# EAGLE design noise_patrol_board (EAGLE 9.6.2)
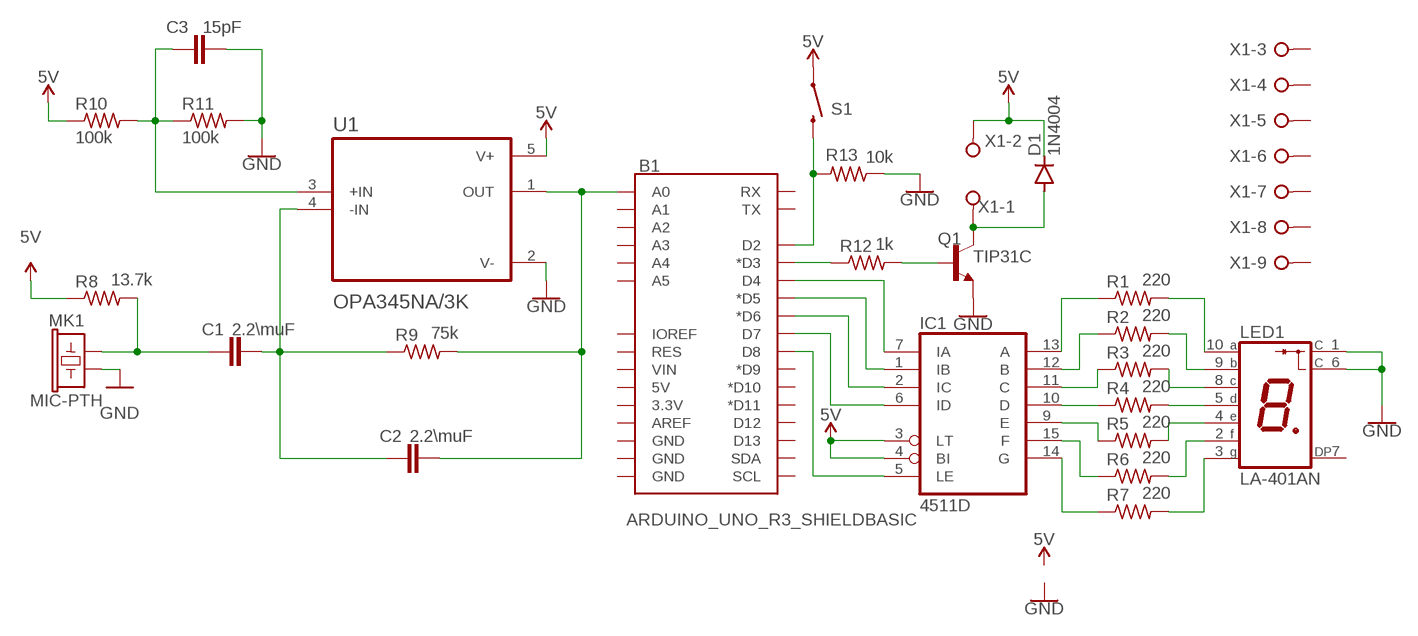
[diagram p0: schematic, sheet 1]

## Parts
B1  ARDUINO_UNO_R3_SHIELDBASIC  [UNO_R3_SHIELD]
C1  2.2\muF  0.22UF-0603-50V-10%  [0603]
C2  2.2\muF  0.22UF-0603-50V-10%  [0603]
C3  15pF  0.22UF-0603-50V-10%  [0603]
D1  1N4004  [DO41-10]
IC1  4511D  [SO16]
LED1  LA-401AN  [LA-401]
MK1  MIC-PTH  [MICROPHONE-PTH-9.7MM]
Q1  TIP31C  [TO220]
R1  220  R-US_0204/7  [0204/7]
R2  220  R-US_0204/7  [0204/7]
R3  220  R-US_0204/7  [0204/7]
R4  220  R-US_0204/7  [0204/7]
R5  220  R-US_0204/7  [0204/7]
R6  220  R-US_0204/7  [0204/7]
R7  220  R-US_0204/7  [0204/7]
R8  13.7k  R-US_M1206  [M1206]
R9  75k  R-US_M1206  [M1206]
R10  100k  R-US_M1206  [M1206]
R11  100k  R-US_M1206  [M1206]
R12  1k  R-US_M1206  [M1206]
R13  10k  R-US_M1206  [M1206]
S1  Reset button  MOMENTARY-SWITCH-SPST-PTH-6.0MM  [TACTILE_SWITCH_PTH_6.0MM]
U1  OPA345NA/3K  [SOT95P280X145-5N]
X1  W237-09P  [W237-9P]

## Nets
5V: D1.C IC1.3(LT) IC1.4(BI) R8.1 R10.1 S1.1 U1.5(V+) X1.2
GND: C3.2 LED1.1(C) LED1.6(C) MK1.GND Q1.3(E) R11.2 R13.1 U1.2(V-)
N$1: IC1.12(B) R2.1
N$2: IC1.11(C) R3.1
N$3: IC1.10(D) R4.1
N$4: IC1.9(E) R5.1
N$5: IC1.15(F) R6.1
N$6: IC1.14(G) R7.1
N$7: LED1.3(G) R7.2
N$8: LED1.2(F) R6.2
N$9: LED1.4(E) R5.2
N$10: LED1.5(D) R4.2
N$11: LED1.8(C) R3.2
N$12: LED1.9(B) R2.2
N$13: LED1.10(A) R1.2
N$14: B1.D4 IC1.7(IA)
N$15: B1.D5(*D5) IC1.1(IB)
N$16: B1.D6(*D6) IC1.2(IC)
N$17: B1.D7 IC1.6(ID)
N$18: B1.A0 C2.2 R9.2 U1.1(OUT)
N$19: B1.D8 IC1.5(LE)
N$20: C1.1 MK1.OUT R8.2
N$21: C1.2 C2.1 R9.1 U1.4(-IN)
N$22: B1.D3(*D3) R12.1
N$23: Q1.1(B) R12.2
N$24: C3.1 R10.2 R11.1 U1.3(+IN)
N$25: D1.A Q1.2(C) X1.1
N$27: B1.D2 R13.2 S1.3
TOOL: IC1.13(A) R1.1
Unconnected: B1.3.3V B1.5V B1.A1 B1.A2 B1.A3 B1.A4 B1.A5 B1.AREF B1.D9(*D9) B1.D10(*D10) B1.D11(*D11) B1.D12 B1.D13 B1.GND@0(GND) B1.GND@1(GND) B1.GND@2(GND) B1.IOREF B1.RES B1.RX B1.SCL B1.SDA B1.TX B1.VIN LED1.7(DP) X1.3 X1.4 X1.5 X1.6 X1.7 X1.8 X1.9

## Power pins joined to a net without a drawn wire
VDD: IC1.16(VDD)
VSS: IC1.8(VSS)

## Library data of the parts
B1 = SparkFun-Boards:ARDUINO_UNO_R3_SHIELD: Arduino R3 Shield Footprint Shield form compatible with the Arduino Uno R3. SparkFun Products: MG2639 Cellular Shield <https://www.sparkfun.com/products/13120> MIDI Shield <https://www.sparkfun.com/products/12898> R3 Stackable Headers Kit <https://www.sparkfun.com/products/11417>
C1-C3 = SparkFun-Capacitors:0.22UF: 0.22µF ceramic capacitors A capacitor is a passive two-terminal electrical component used to store electrical energy temporarily in an electric field.; PROD_ID: CAP-15456; VALUE: 0.22uF
D1 = diode:1N4004: DIODE general purpose rectifier, 1 A
IC1 = 45xx:4511: BCD to 7-segment LATCH/DECODER/DRIVER
LED1 = led-7-segment:LA-401*N: Single Digit LED Numeric Display (cathode common) Source: ROHM .. la-1401dn.pdf; OC_FARNELL: unknown; OC_NEWARK: unknown
MK1 = SparkFun-Sensors:MIC: Microphone Omni-directional electret microphones - one through-hole, the other SMD. Datasheet <http://cdn.sparkfun.com/datasheets/Sensors/Sound/CEM-C9745JAD462P2.54R.pdf> (through-hole mic) Datasheet <http://www.challengeelectronics.com/downloads/microphones/omni_directional/CEM-OB6018-3EAD443C43MR.pdf> (SMD mic) SparkFun Products PTH Electret Microphone <https://www.sparkfun.com/products/8635> (COM-08635) SparkFun Electret Microphone Breakout <https://www.sparkfun.com/products/9964> (BOB-09964) Digital Sandbox <https://www.sparkfun.com/products/12651> (DEV-12651) SparkFun Sound Detector <https://www.sparkfun.com/products/12642> (SEN-12642) SMD Microphone SparkFun Voice Recorder Breakout - ISD1932 <https://www.sparkfun.com/products/retired/10653> (BOB-10653); PROD_ID: COMP-08856; SF_ID: COM-08635
Q1 = transistor-npn:TIP31C*: NPN Transistor
R1-R13 = rcl:R-US_: RESISTOR, American symbol; SPICEPREFIX: R
S1 = SparkFun-Switches:MOMENTARY-SWITCH-SPST: Momentary Switch (Pushbutton) - SPST Normally-open (NO) SPST momentary switches (buttons, pushbuttons). Variants PTH-12MM - 12mm square, through-hole Momentary Pushbutton Switch - 12mm Square <https://www.sparkfun.com/products/9190> (COM-09190) PTH-6.0MM, PTH-6.0MM-KIT - 6.0mm square, through-hole Mini Pushbutton Switch <https://www.sparkfun.com/products/97> (COM-00097) KIT package intended for soldering kit's - only one side of pads' copper is exposed. PTH-RIGHT-ANGLE-KIT - Right-angle, through-hole Right Angle Tactile Button <https://www.sparkfun.com/products/10791> - Used on SparkFun BigTime Watch Kit <https://www.sparkfun.com/products/11734> SMD-12MM - 12mm square, surface-mount Tactile Button - SMD (12mm) <https://www.sparkfun.com/products/12993> (COM-12993) Used on SparkFun PicoBoard <https://www.sparkfun.com/products/11888> SMD-4.5MM - 4.5mm Square Trackball Switch Used on SparkFun Blackberry Trackballer Breakout <https://www.sparkfun.com/products/13169> SMD-4.6MMX2.8MM - 4.60mm x 2.80mm, surface mount Used on SparkFun Pro Micro - RP2040 <https://www.sparkfun.com/products/17717> SMD-5.2MM, SMD-5.2-REDUNDANT - 5.2mm square, surface-mount Mini Pushbutton Switch - SMD <https://www.sparkfun.com/products/8720> (COM-08720) Used on Arduino Pro Mini <https://www.sparkfun.com/products/11114> REDUNDANT package connects both switch circuits together SMD-6.0X3.5MM - 6.0 x 3.5mm, surface mount Momentary Reset Switch SMD <https://www.sparkfun.com/products/8229> (COM-08229) SMD-6.2MM-TALL - 6.2mm square, surface mount Tactile Button - SMD (6mm) <https://www.sparkfun.com/products/12992> Used on SparkFun Digital Sandbox <https://www.sparkfun.com/products/12651> SMD-RIGHT-ANGLE - Right-angle, surface mount Used on SparkFun Block for Intel® Edison - Arduino <https://www.sparkfun.com/products/13036>; PROD_ID: SWCH-08441; SF_SKU: COM-00097
U1 = OPA345NA_3K:OPA345NA/3K; CHECK_PRICES: https://www.snapeda.com/parts/OPA345NA/3K/Texas+Instruments/view-part/?ref=eda; DESCRIPTION: Single, 5.5-V, 3-MHz, RRIO operational amplifier; DIGIKEY_PART_NUMBER: 296-50370-1-ND; MF: Texas Instruments; MP: OPA345NA/3K; PACKAGE: SOT-23-5 Texas Instruments; SNAPEDA_LINK: https://www.snapeda.com/parts/OPA345NA/3K/Texas+Instruments/view-part/?ref=snap
X1 = con-wago-508:W237-09P: WAGO SREW CLAMP; OC_FARNELL: unknown; OC_NEWARK: unknown

## Module VE
Ports: 

### Library data of the parts

## Board
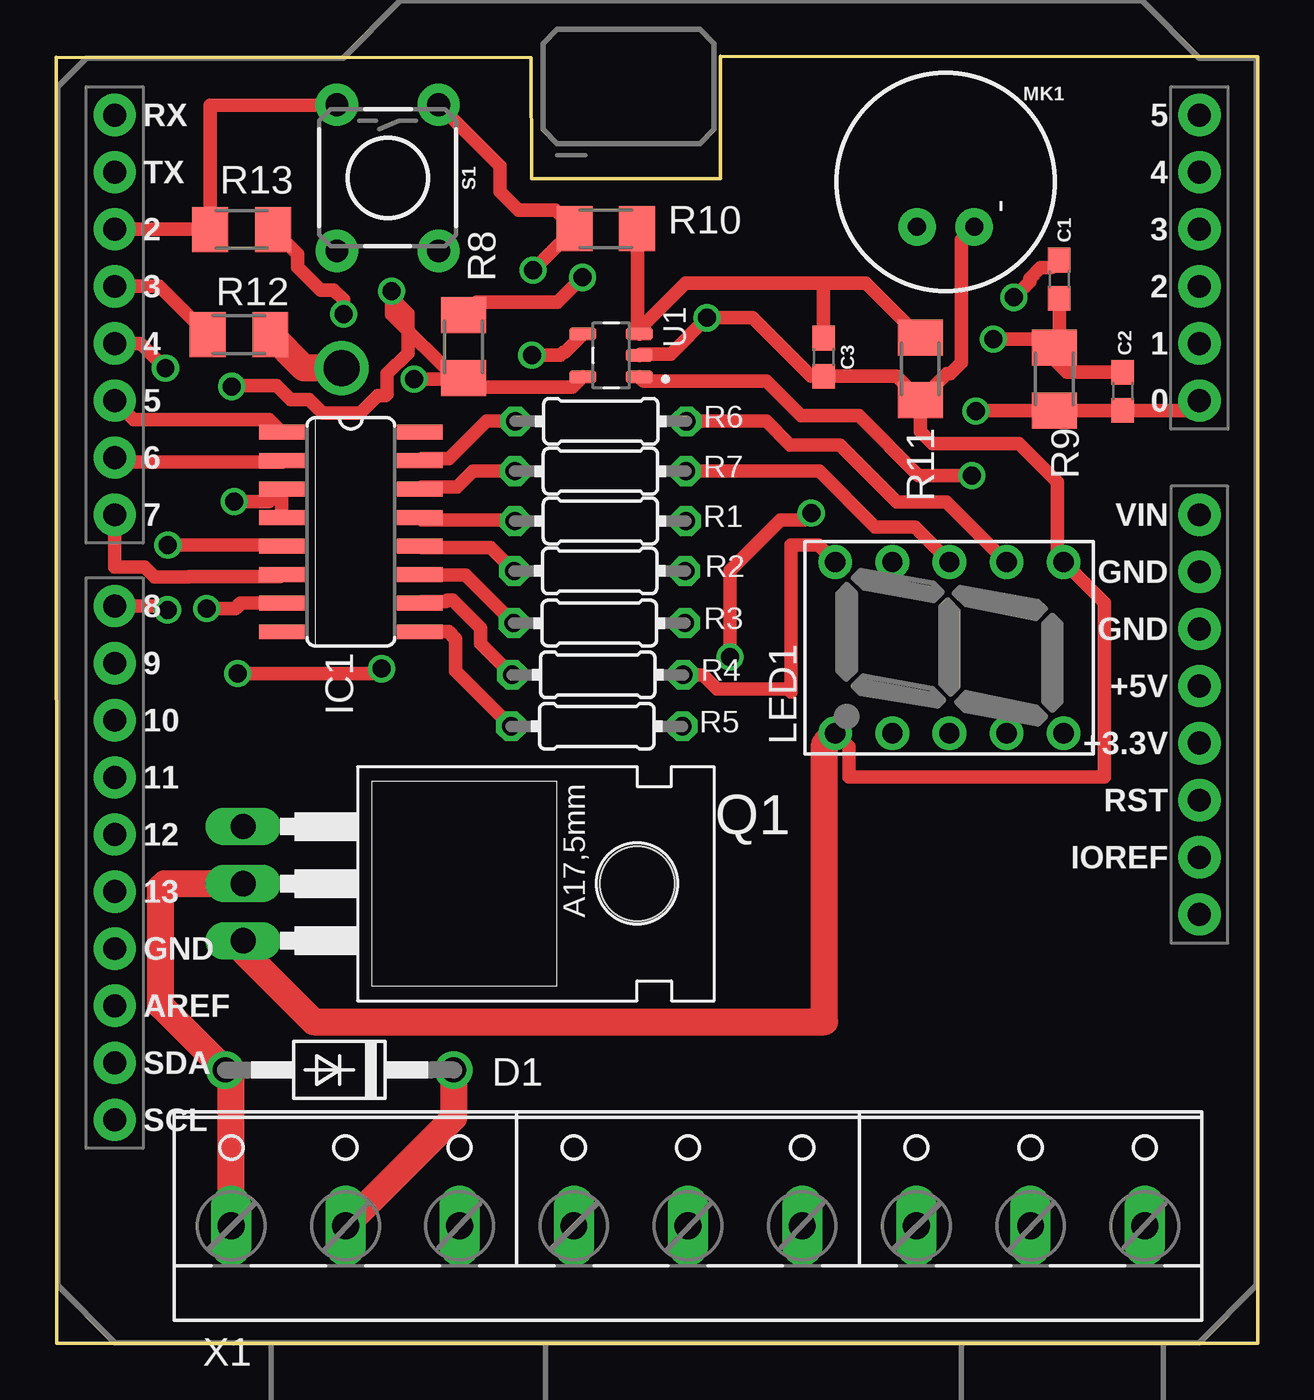
[diagram p1: board, top side]
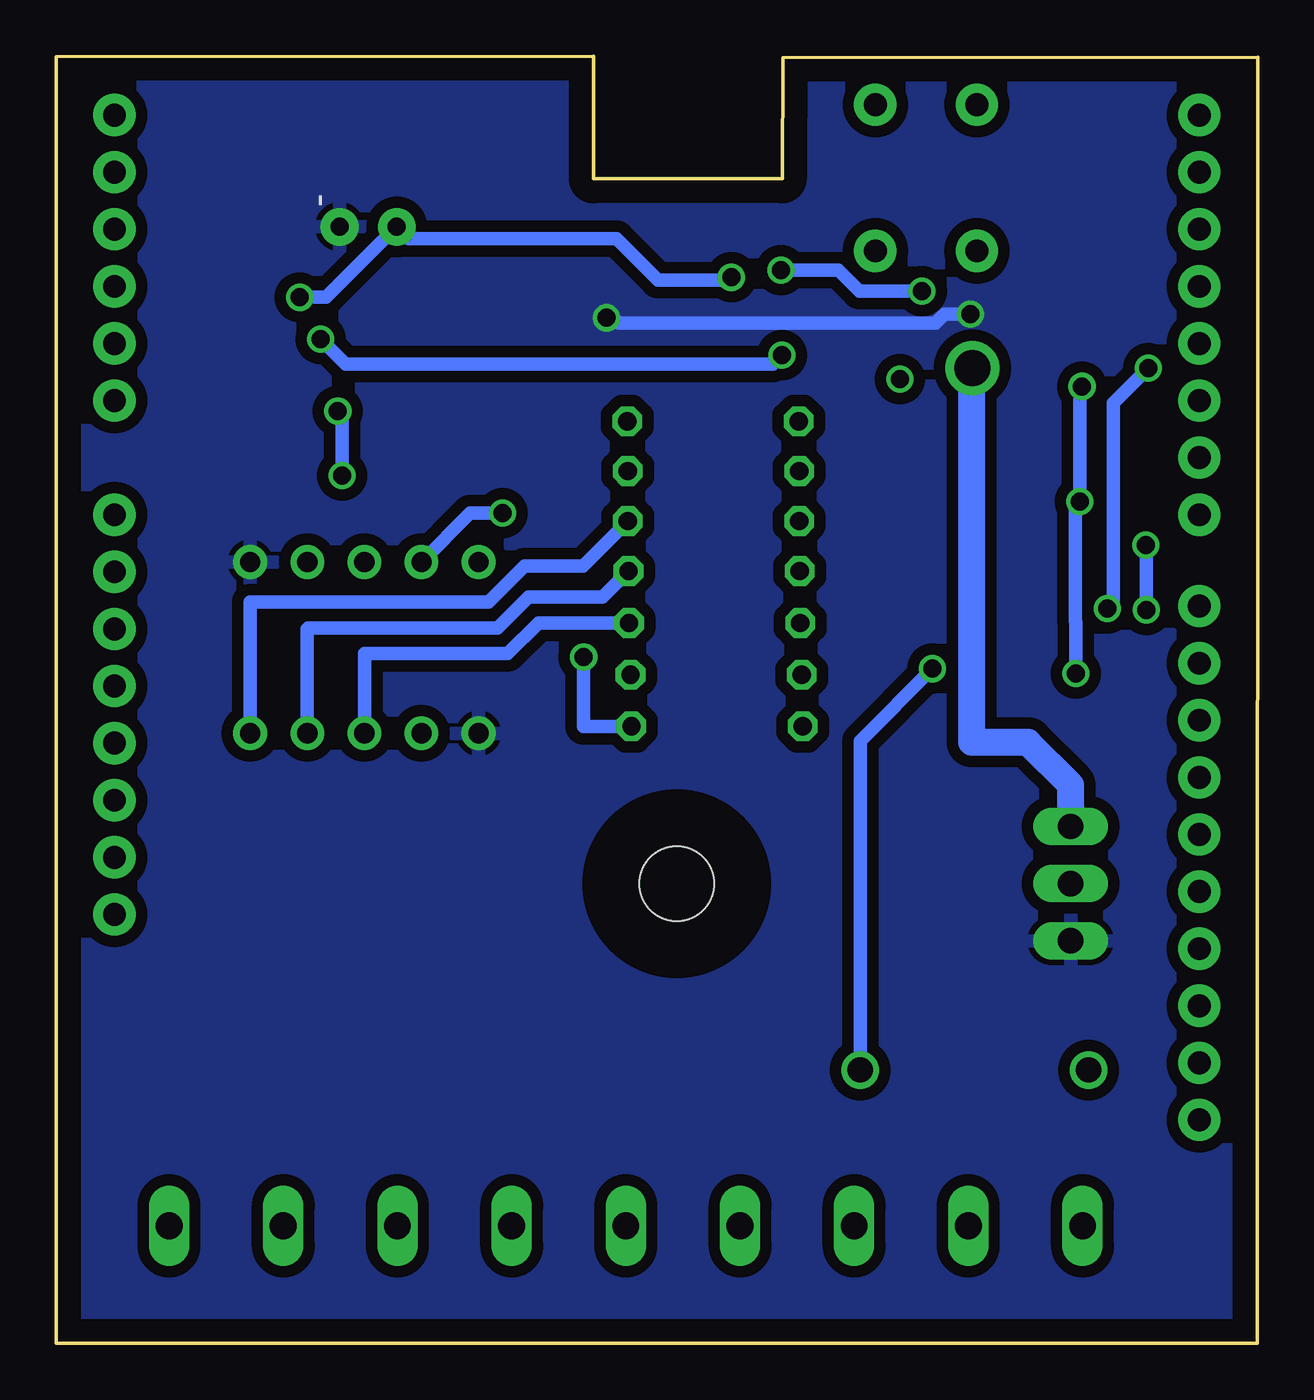
[diagram p2: board, bottom side, seen from below]

Size 53.45 x 57.26 mm. Coordinates in mm from the lower left corner, seen from the top.
Outline: 21.12,57.2 21.15,51.8 29.55,51.8 29.55,57.26 53.45,57.23 53.45,0.01 0.02,0 0,57.22 21.12,57.2
Copper layers (1*16): Top 0.035mm / dielectric 1.5mm / Bottom 0.035mm
Design rules "noise_patrol": minimum track width 0.6mm, minimum drill 0.35mm, track to track 20mil, track to pad 20mil, pad to pad 20mil, via to via 20mil, smd to smd 6mil, copper to edge 40mil, drill to drill 6mil, minimum pad ring 10mil, minimum via ring 8mil, stop-mask expansion 4mil, vias tented up to drill 0mil, thermal gap 10mil

### Footprints (pad centres in the part's own frame; a part is rotated, then mirrored left to right if it is on the bottom)
UNO_R3_SHIELD = drill 1.016 pad 1.88: 3.3V 24.13,-2.54; 5V 24.13,0; A0 24.13,12.7; A1 24.13,15.24; A2 24.13,17.78; A3 24.13,20.32; A4 24.13,22.86; A5 24.13,25.4; AREF -24.13,-14.224; D2 -24.13,20.32; D3 -24.13,17.78; D4 -24.13,15.24; D5 -24.13,12.7; D6 -24.13,10.16; D7 -24.13,7.62; D8 -24.13,3.556; D9 -24.13,1.016; D10 -24.13,-1.524; D11 -24.13,-4.064; D12 -24.13,-6.604; D13 -24.13,-9.144; GND@0 24.13,2.54; GND@1 24.13,5.08; GND@2 -24.13,-11.684; IOREF 24.13,-7.62; NC 24.13,-10.16; RES 24.13,-5.08; RX -24.13,25.4; SCL -24.13,-19.304; SDA -24.13,-16.764; TX -24.13,22.86; VIN 24.13,7.62
0603 = smd 1.1 x 1: 1 -0.85,0; 2 0.85,0
DO41-10 = drill 1.118: A 5.08,0; C -5.08,0
SO16 = smd 0.66 x 2.032: 1 -4.445,-3.073; 2 -3.175,-3.073; 3 -1.905,-3.073; 4 -0.635,-3.073; 5 0.635,-3.073; 6 1.905,-3.073; 7 3.175,-3.073; 8 4.445,-3.073; 9 4.445,3.073; 10 3.175,3.073; 11 1.905,3.073; 12 0.635,3.073; 13 -0.635,3.073; 14 -1.905,3.073; 15 -3.175,3.073; 16 -4.445,3.073
LA-401 = drill 0.9 pad 1.5: 1 -3.81,5.08; 2 -3.81,2.54; 3 -3.81,0; 4 -3.81,-2.54; 5 -3.81,-5.08; 6 3.81,-5.08; 7 3.81,-2.54; 8 3.81,0; 9 3.81,2.54; 10 3.81,5.08
MICROPHONE-PTH-9.7MM = drill 0.8 pad 1.676: GND -2,-1.27; OUT -2,1.27
TO220 = drill 1.118 long: 1 -2.54,-6.35; 2 0,-6.35; 3 2.54,-6.35 | hole 3.302: 0,11.176
0204/7 = drill 0.813 octagon: 1 -3.81,0; 2 3.81,0
M1206 = smd 1.6 x 2: 1 -1.4,0; 2 1.4,0
TACTILE_SWITCH_PTH_6.0MM = drill 1.016 pad 1.88: 1 -3.251,2.261; 2 3.251,2.261; 3 -3.251,-2.261; 4 3.251,-2.261
SOT95P280X145-5N = smd 1.21 x 0.59: 1 -1.255,0.95; 2 -1.255,0; 3 -1.255,-0.95; 4 1.255,-0.95; 5 1.255,0.95
W237-9P = drill 1.194 long: 1 -20.32,-0.635; 2 -15.24,-0.635; 3 -10.16,-0.635; 4 -5.08,-0.635; 5 0,-0.635; 6 5.08,-0.635; 7 10.16,-0.635; 8 15.24,-0.635; 9 20.32,-0.635

### Placement (x,y rotation side)
B1  26.73,29.24 0 top
C1  44.62,47.34 270 top
C2  47.44,42.35 270 top
C3  34.14,43.87 270 top
D1  12.6,12.16 180 top
IC1  13.11,36.1 270 top
LED1  39.74,30.95 270 top
MK1  39.57,51.67 90 top
Q1  14.67,20.45 270 top
R1  24.21,36.58 0 top
R2  24.18,34.36 0 top
R3  24.16,32.04 0 top
R4  24.09,29.74 0 top
R5  24.05,27.45 0 top
R6  24.23,41.02 0 top
R7  24.21,38.8 0 top
R8  18.12,44.33 90 top
R9  44.41,42.9 270 top
R10  24.45,49.58 0 top
R11  38.44,43.35 270 top
R12  8.13,44.87 0 top
R13  8.25,49.55 180 top
S1  14.75,51.85 270 top
U1  24.69,43.95 180 top
X1  28.11,5.86 0 top

### Tracks (layer width: path | path; a pad name or v marks a point on that pad's centre or on a via)
5V  (via drill 0.8)
  Top 0.6: IC1.4 IC1.3 9.47,37.44 v7.91,37.44 | S1.1 19.75,52.36 19.76,51.8 19.76,51.22 20.17,50.81 20.58,50.41 22.22,50.41 R10.1 v21.21,47.74 | 18.42,42.9 18.39,42.93 R8.1 17.77,42.93 14.93,45.77 v14.93,46.81 14.79,46.67 15.65,45.8 15.65,44.06 14.72,43.13 14.72,42.22 14.66,42.16 14.3,42.16 13.52,41.38 11.86,41.38 11.26,41.98 10.43,41.98 9.81,42.6 7.84,42.6 v7.81,42.57 | 18.42,42.9 v15.92,42.9 | U1.5 22.96,42.53 18.79,42.53 18.42,42.9 | v14.47,30.01 14.26,29.8 v8.08,29.8
  Top 1.2: D1.C 17.68,10.04 X1.2
  Bottom 0.6: v7.81,42.57 7.91,42.47 v7.91,37.44 8.1,37.25 8.1,32.11 8.08,32.08 v8.08,29.8 | v21.21,47.74 18.65,47.74 17.72,46.81 v14.93,46.81 | D1.C 17.68,26.8 v14.47,30.01
GND  (via drill 0.8)
  Top 0.6: LED1.6 35.26,26.54 35.26,25.2 46.62,25.2 46.62,32.96 LED1.1 44.54,35.04 44.54,38.32 42.83,40.03 38.98,40.03 38.44,40.57 R11.2 | R11.2 39.63,43.14 39.78,43.14 40.26,43.63 40.26,49.09 MK1.GND | R11.2 37.37,43.02 C3.2 33.58,43.02 30.98,45.62 v28.96,45.62 27.35,44 27.04,44 26,44 U1.2 | v12.78,45.79 12.78,46.42 12.35,46.85 11.77,46.85 10.74,47.88 10.74,48.46 R13.1
  Top 1.2: Q1.3 8.37,17.86 8.37,17.39 11.45,14.31 34.18,14.31 34.18,26.66 LED1.6
  Bottom 0.6: v12.78,45.79 13.94,45.79 14.34,45.39 28.42,45.39 28.65,45.62 v28.96,45.62
  pour Bottom: 0.01,57.23 21.05,57.23 21.11,57.17 21.21,57.07 21.21,51.79 29.51,51.79 29.56,51.84 29.56,57.2 29.57,57.21 53.42,57.21 53.45,57.18 53.45,0.03 53.47,0.01 0.05,0.01 0.05,57.14 0.23,57.14 0.25,57.16
N$1
  Top 0.6: IC1.12 16.25,35.4 19.33,35.4 R2.1
N$2
  Top 0.6: R3.1 18.21,34.17 16.2,34.17 IC1.11
N$3
  Top 0.6: R4.1 18.88,31.14 18.88,31.82 17.64,33.07 17.41,33.07 17.35,33.01 16.26,33.01 IC1.10
N$4
  Top 0.6: R5.1 17.77,29.92 17.77,31.34 17.46,31.65 IC1.9
N$5
  Top 0.6: IC1.15 16.26,39.36 17.48,39.36 19.15,41.02 R6.1
N$6
  Top 0.6: R7.1 18.54,38.8 17.83,38.09 16.26,38.09 IC1.14
N$7
  Top 0.6: R7.2 33.95,38.8 36.43,36.32 38.2,36.32 39.74,34.78 LED1.3
N$8
  Top 0.6: R6.2 31.59,41.02 32.65,39.96 34.87,39.96 37.41,37.43 39.61,37.43 LED1.2
N$9  (via drill 0.8)
  Top 0.6: v33.59,36.93 33.28,36.62 32.22,36.62 29.98,34.38 v29.98,30.53
  Bottom 0.6: R5.2 29.98,27.45 v29.98,30.53 | v33.59,36.93 35.03,36.93 LED1.4
N$10
  Top 0.6: LED1.5 33.91,35.51 32.68,35.51 32.68,28.97 32.53,29.12 29.39,29.12 28.77,29.74 R4.2
N$11
  Bottom 0.6: R3.2 32,32.04 33.36,30.68 39.74,30.68 LED1.8
N$12
  Bottom 0.6: R2.2 29.15,33.2 32.43,33.2 33.81,31.82 42.24,31.82 42.28,31.78 LED1.9
N$13
  Bottom 0.6: R1.2 30.01,34.59 32.61,34.59 34.22,32.98 44.82,32.98 LED1.10
N$14  (via drill 0.8)
  Top 0.6: B1.D4 3.77,44.48 v4.86,43.39 | v6.69,32.69 7.98,32.69 8.21,32.92 IC1.7
  Bottom 0.6: v4.86,43.39 6.42,41.83 6.42,32.96 v6.69,32.69
N$15
  Top 0.6: B1.D5 3.44,41.1 9.48,41.1 IC1.1
N$16
  Top 0.6: B1.D6 2.8,39.2 10.11,39.2 IC1.2
N$17
  Top 0.6: B1.D7 2.6,34.55 2.61,34.54 3.94,34.54 4.38,34.1 5.89,34.1 5.91,34.11 9.95,34.11 IC1.6
N$18  (via drill 0.8)
  Top 0.6: B1.A0 50.42,41.5 C2.2 R9.2 40.95,41.5 v40.92,41.47 | U1.1 26.14,42.81 31.6,42.81 33.14,41.26 35.71,41.26 38.36,38.61 v40.73,38.61
  Bottom 0.6: v40.73,38.61 v40.74,38.62 40.74,41.29 v40.92,41.47
N$19  (via drill 0.8)
  Top 0.6: B1.D8 4.78,32.8 v4.95,32.63 | IC1.5 9.99,35.51 v4.97,35.51
  Bottom 0.6: v4.95,32.63 4.95,35.49 v4.97,35.51
N$20  (via drill 0.8)
  Top 0.6: v23.42,47.42 22.31,46.31 18.7,46.31 R8.2 | C1.1 44.28,47.85 43.78,47.85 43.31,47.38 43.31,47.23 v42.61,46.53
  Bottom 0.6: v23.42,47.42 23.54,47.3 26.68,47.3 28.52,49.14 37.77,49.14 MK1.OUT 41.44,46.53 v42.61,46.53
N$21  (via drill 0.8)
  Top 0.6: C2.1 44.97,43.2 44.41,43.76 R9.1 | C1.2 44.62,44.51 R9.1 | U1.4 22.64,44.1 22.58,44.1 22.44,43.96 v21.16,43.96 | v41.69,44.67 44.04,44.67 R9.1
  Bottom 0.6: v21.16,43.96 21.56,43.56 40.58,43.56 v41.69,44.67
N$22
  Top 0.6: B1.D3 4.58,47.02 R12.1
N$23  (via drill 1.6)
  Top 1.2: v12.69,43.39 11.01,43.39 R12.2
  Bottom 1.2: Q1.1 8.32,24.83 10.22,26.73 12.72,26.73 12.72,43.36 v12.69,43.39
N$24
  Top 0.6: R11.1 36.02,47.17 28,47.17 27.99,47.16 | U1.3 25.94,45.18 | R10.2 25.86,45.18 25.94,45.18 | C3.1 34.14,47.16 27.99,47.16 | 27.99,47.16 26.01,45.18 25.94,45.18
N$25
  Top 1.2: X1.1 7.79,11.89 D1.A 4.65,15.03 4.65,20.26 4.84,20.45 Q1.2
N$27
  Top 0.6: B1.D2 R13.2 | S1.3 12.46,55.07 6.84,55.07 R13.2 | R13.2
TOOL
  Top 0.6: R1.1 20.35,36.63 16.29,36.63 IC1.13